# EAGLE design haasoscope_triggerout_board (EAGLE 9.6.2)
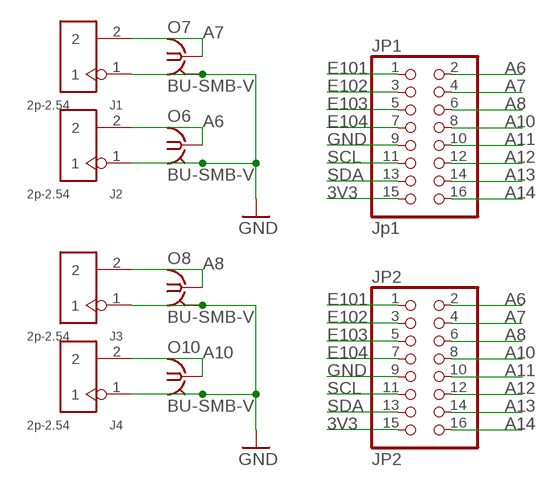
[diagram p0: schematic, sheet 1]

## Parts
J1  2p-2.54  DIP-BLACK-MALE-HEADER-VERT(2P-2.54)  [H2-2.54]
J2  2p-2.54  DIP-BLACK-MALE-HEADER-VERT(2P-2.54)  [H2-2.54]
J3  2p-2.54  DIP-BLACK-MALE-HEADER-VERT(2P-2.54)  [H2-2.54]
J4  2p-2.54  DIP-BLACK-MALE-HEADER-VERT(2P-2.54)  [H2-2.54]
JP1  Jp1  PINHD-2X8  [2X08]
JP2  JP2  PINHD-2X8  [2X08]
O6  BU-SMB-V  [BU-SMB-V]
O7  BU-SMB-V  [BU-SMB-V]
O8  BU-SMB-V  [BU-SMB-V]
O10  BU-SMB-V  [BU-SMB-V]

## Nets
3V3: JP1.15 JP2.15
A6: J2.2 JP1.2 JP2.2 O6.1
A7: J1.2 JP1.4 JP2.4 O7.1
A8: J3.2 JP1.6 JP2.6 O8.1
A10: J4.2 JP1.8 JP2.8 O10.1
A11: JP1.10 JP2.10
A12: JP1.12 JP2.12
A13: JP1.14 JP2.14
A14: JP1.16 JP2.16
E101: JP1.1 JP2.1
E102: JP1.3 JP2.3
E103: JP1.5 JP2.5
E104: JP1.7 JP2.7
GND: J1.1 J2.1 J3.1 J4.1 JP1.9 JP2.9 O6.2 O6.3 O6.4 O6.5 O7.2 O7.3 O7.4 O7.5 O8.2 O8.3 O8.4 O8.5 O10.2 O10.3 O10.4 O10.5
SCL: JP1.11 JP2.11
SDA: JP1.13 JP2.13

## Library data of the parts
J1-J4 = Seeed-Connector:DIP-BLACK-MALE-HEADER-VERT(2P-2.54): 320020016; MPN: P125-1102A0BS116A1
JP1 JP2 = pinhead:PINHD-2X8: PIN HEADER
O6-O8 O10 = con-coax:BU-SMB-V: FEMALE SMB CONNECTOR Radiall distributor RS 112-2993; OC_FARNELL: unknown; OC_NEWARK: unknown

## Net classes
0 default: width 0.508 mm

## Board
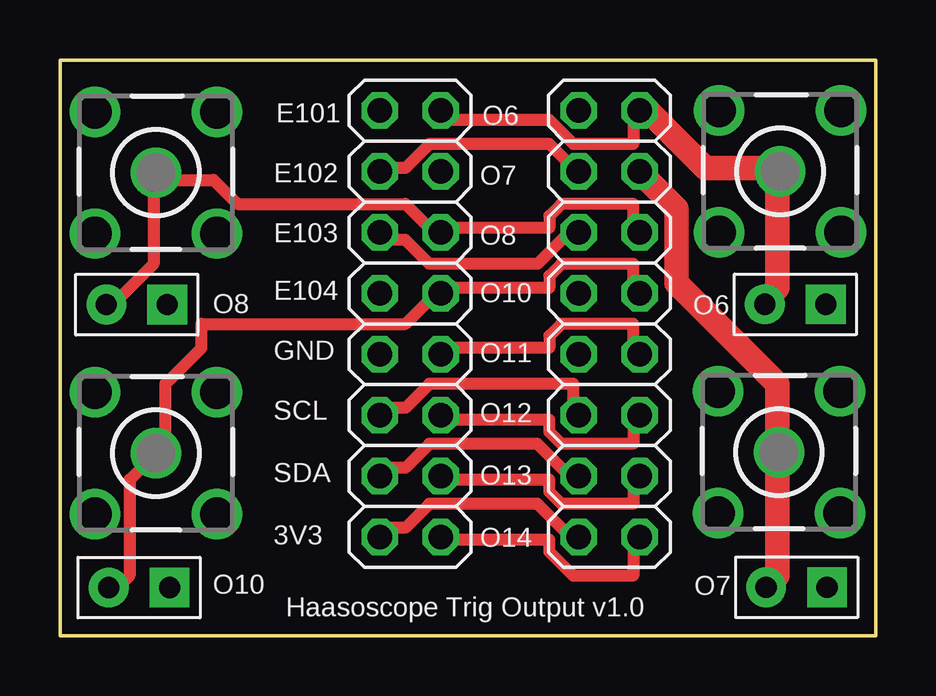
[diagram p1: board, top side]
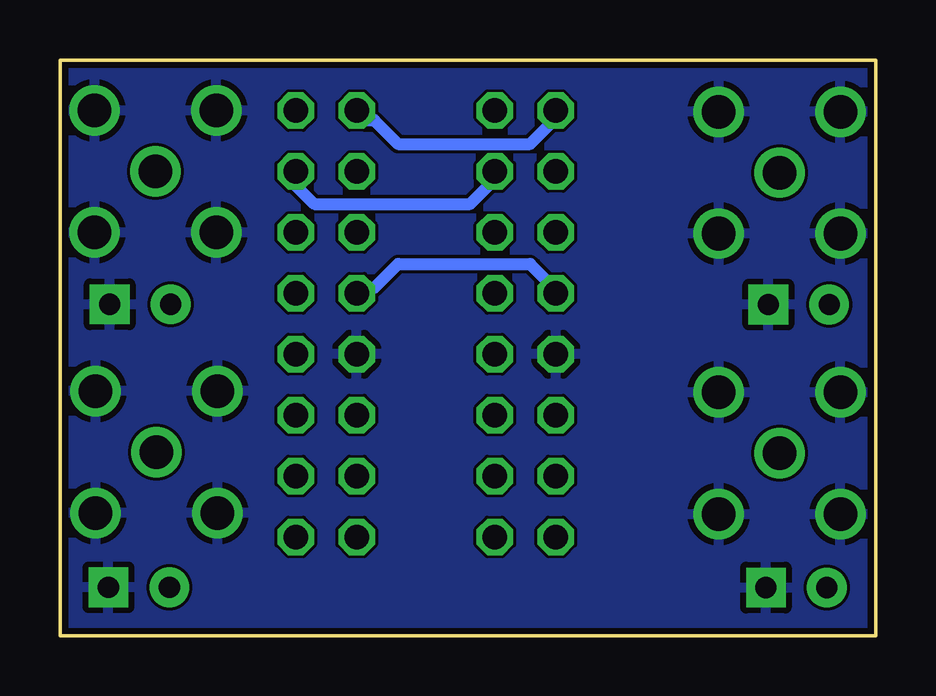
[diagram p2: board, bottom side, seen from below]

Size 34 x 24 mm. Coordinates in mm from the lower left corner, seen from the top.
Outline: 0,0 0,24 34,24 34,0 0,0
Copper layers (1*16): Top 0.035mm / dielectric 1.5mm / Bottom 0.035mm
Design rules "MF_Standard_2_Layer": minimum track width 5mil, minimum drill 12mil, track to track 5mil, track to pad 5mil, pad to pad 5mil, via to via 5mil, smd to smd 0mil, copper to edge 10mil, drill to drill 10mil, minimum pad ring 6mil, minimum via ring 6mil, stop-mask expansion 2mil, vias tented up to drill 25mil, thermal gap 10mil

### Footprints (pad centres in the part's own frame; a part is rotated, then mirrored left to right if it is on the bottom)
H2-2.54 = drill 0.889 pad 1.651 square: 1 0,1.27 | drill 0.889 pad 1.651: 2 0,-1.27
2X08 = drill 1.016 octagon: 1 -8.89,-1.27; 2 -8.89,1.27; 3 -6.35,-1.27; 4 -6.35,1.27; 5 -3.81,-1.27; 6 -3.81,1.27; 7 -1.27,-1.27; 8 -1.27,1.27; 9 1.27,-1.27; 10 1.27,1.27; 11 3.81,-1.27; 12 3.81,1.27; 13 6.35,-1.27; 14 6.35,1.27; 15 8.89,-1.27; 16 8.89,1.27
BU-SMB-V = drill 1.4: 1 0,0; 2 -2.54,2.54; 3 2.54,2.54; 4 2.54,-2.54; 5 -2.54,-2.54

### Placement (x,y rotation side)
J1  30.71,2.01 270 top
J2  30.66,13.81 270 top
J3  3.2,13.8 270 top
J4  3.3,2 270 top
JP1  22.9,13 270 top
JP2  14.6,13 270 top
O6  30.02,19.35 0 top
O7  29.97,7.65 0 top
O8  4,19.3 0 top
O10  4,7.6 0 top

### Tracks (layer width: path | path; a pad name or v marks a point on that pad's centre or on a via)
3V3
  Top 0.508: JP2.15 13.4,4.5 14.4,4.5 15.4,5.5 19.9,5.5 21.4,4 JP1.15
A6
  Top 0.508: JP2.2 15.9,21.5 20.4,21.5 21.4,20.5 23.9,20.5 23.9,21.5 JP1.2 | 29.9,19 O6.1 29.9,19.5
  Top 1.016: 29.9,19 29.9,14.5 29.4,14 J2.2 | JP1.2 24.51,21.89 26.9,19.5 29.9,19.5
A7
  Top 0.508: 29.9,8 O7.1
  Top 1.016: J1.2 29.9,2.5 29.9,7.5 O7.1 | 29.9,8 29.9,10.5 25.7,14.7 25.7,17.8 24.21,19.29 JP1.4
  Bottom 0.508: JP2.4 15.9,19 16.9,18 23.4,18 24.4,19 JP1.4
A8
  Top 0.508: JP1.6 23.9,17 23.9,18 20.9,18 20.4,17.5 20.4,17 15.9,17 JP2.6 15.4,17 14.4,18 7.4,18 6.4,19 4.4,19 O8.1 3.9,19 3.9,15.5 2.4,14 J3.2
A10
  Top 0.508: JP1.8 23.9,14.5 23.9,15.5 20.9,15.5 20.4,15 20.4,14.5 15.9,14.5 JP2.8 15.4,14 14.4,13 5.9,13 5.9,12 4.4,10.5 4.4,8 O10.1 2.9,6.5 2.9,2.5 2.4,2 J4.2
A11
  Top 0.508: JP2.10 15.9,12 20.4,12 20.4,12.5 20.9,13 23.9,13 23.9,12 JP1.10
A12
  Top 0.508: JP2.12 15.9,9 20.4,9 20.4,8.5 20.9,8 23.9,8 23.9,9 JP1.12
A13
  Top 0.508: JP2.14 15.9,6.5 20.4,6.5 20.4,6 20.9,5.5 23.9,5.5 23.9,6.5 JP1.14
A14
  Top 0.508: JP2.16 15.9,4 20.4,4 20.4,3.5 21.4,2.5 23.9,2.5 23.9,4 JP1.16
E101
  Bottom 0.508: JP2.1 13.4,21.5 14.4,20.5 19.9,20.5 20.9,21.5 21.4,21.5 JP1.1
E102
  Top 0.508: JP2.3 13.4,19.5 14.4,19.5 15.4,20.5 20.4,20.5 21.4,19.5 JP1.3
E103
  Top 0.508: JP2.5 13.4,16.5 14.4,16.5 15.4,15.5 19.9,15.5 21.4,17 JP1.5
E104
  Bottom 0.508: JP2.7 13.4,14.5 14.4,15.5 19.9,15.5 20.9,14.5 21.4,14.5 JP1.7
GND
  pour Bottom: -2.1,25 35.9,25 35.9,-1 -2.1,-1
SCL
  Top 0.508: JP2.11 13.4,9.5 14.4,9.5 15.4,10.5 21.4,10.5 21.4,9.5 JP1.11
SDA
  Top 0.508: JP2.13 13.4,7 14.4,7 15.4,8 19.9,8 21.4,6.5 JP1.13

### Text on the board
tPlace: E101 | O6 | E102 | O7 | E103 | O8 | E104 | O10 | GND | O11 | SCL | O12 | SDA | O13 | 3V3 | O14 | Haasoscope Trig Output v1.0